# EAGLE schematic vaha_esp8266 (EAGLE 9.0.1)
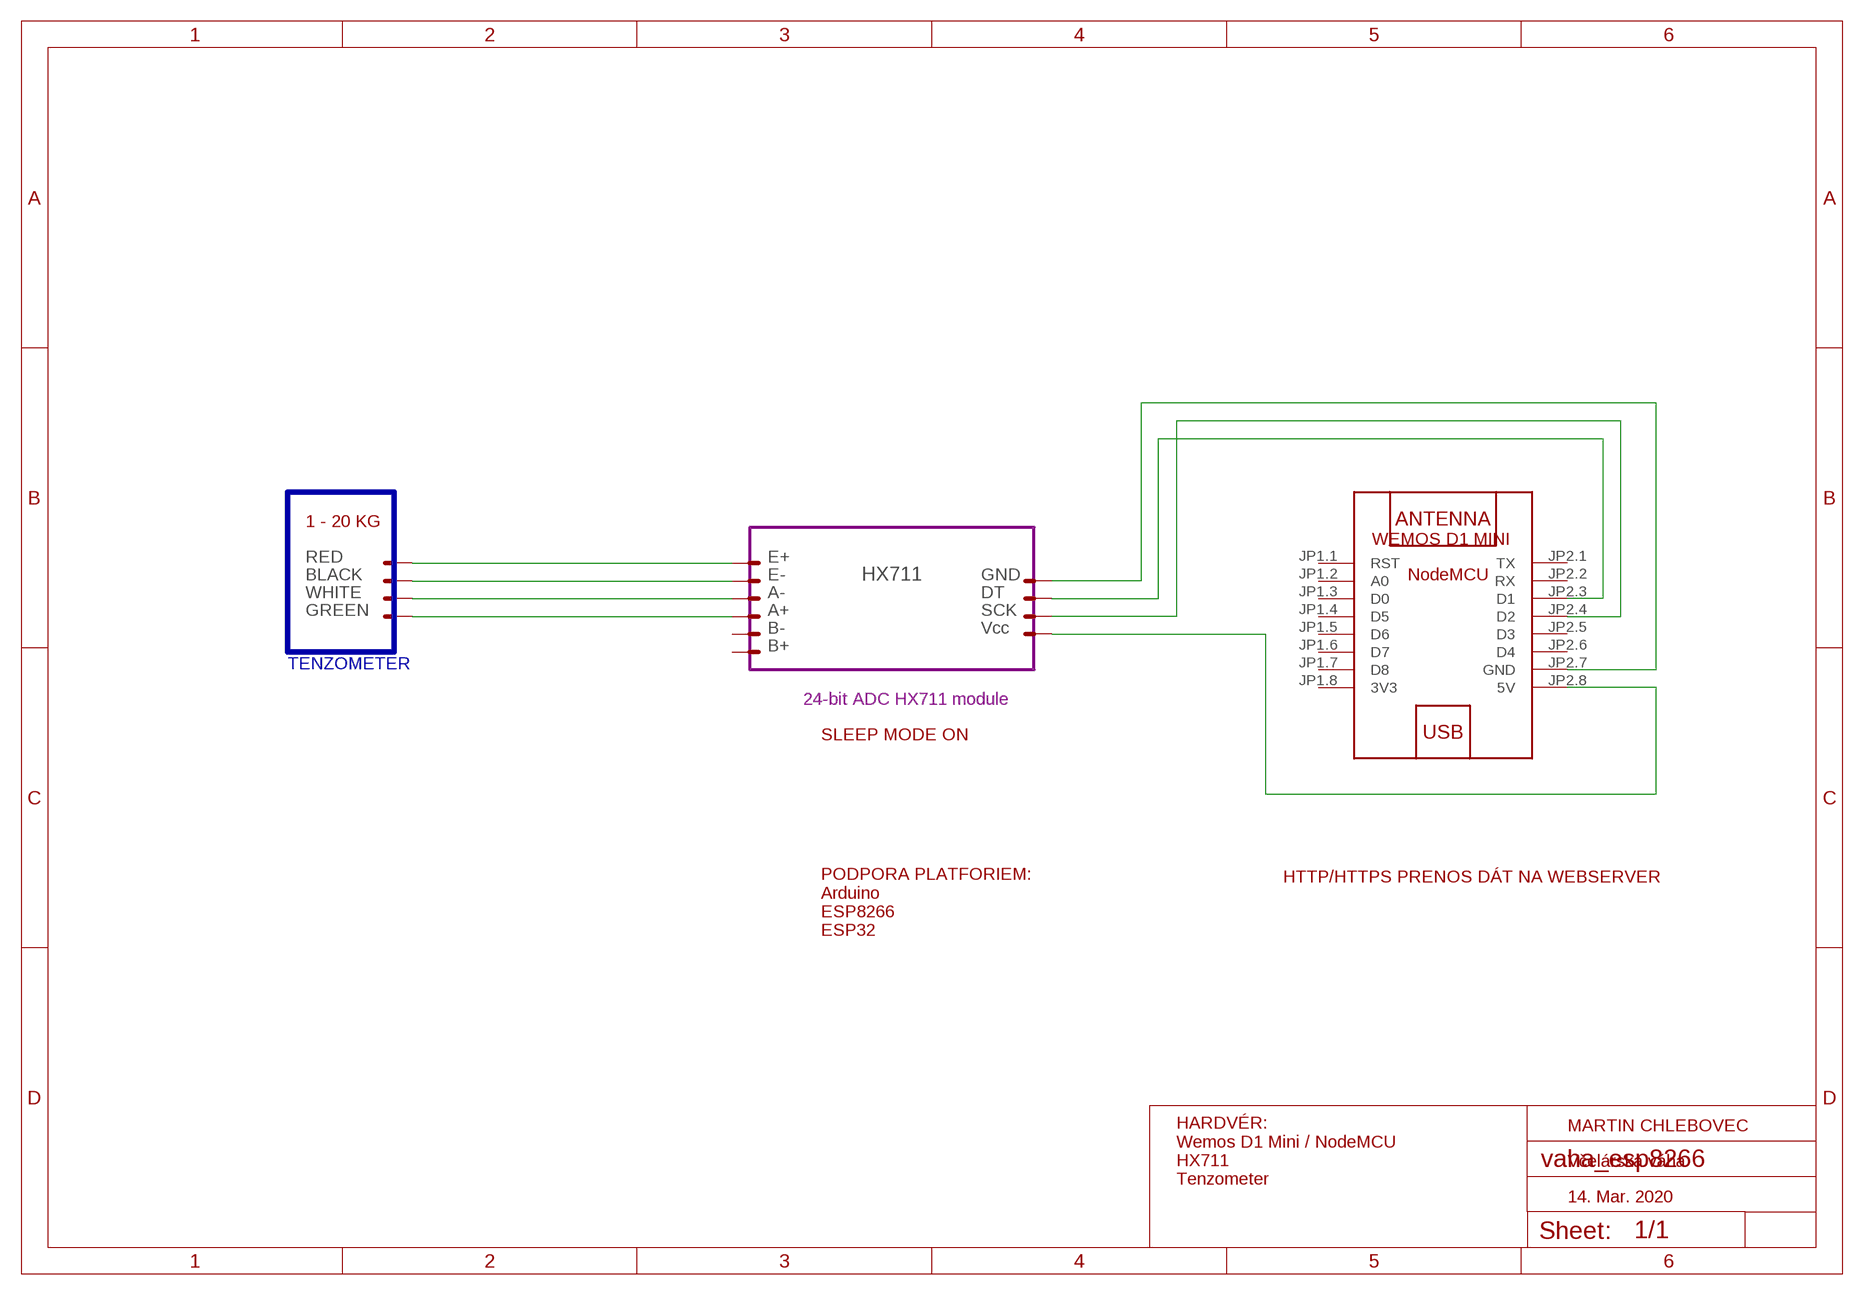
[diagram p0: schematic, sheet 1]

## Parts
U$1  WEMOS-D1-MINI  [WEMOS-D1-MINI]
X1  332-02  [332-02]
X2  332-02  [332-02]
X3  332-02  [332-02]
X4  332-02  [332-02]
X5  332-02  [332-02]
X6  332-02  [332-02]
X7  332-02  [332-02]
X8  332-02  [332-02]
X9  332-02  [332-02]
X10  332-02  [332-02]
X11  332-02  [332-02]
X12  332-02  [332-02]
X13  332-02  [332-02]

## Module instances
HX711 = HX711

## Nets
N$1: U$1.JP2.8(5V) X3.2
N$2: U$1.JP2.7(GND) X1.1
N$3: U$1.JP2.3(D1) X1.2
N$4: U$1.JP2.4(D2) X2.2
N$5: X4.2 X10.2
N$6: X5.2 X11.2
N$7: X6.2 X12.2
N$8: X7.2 X13.2
Unconnected: U$1.JP1.1(RST) U$1.JP1.2(A0) U$1.JP1.3(D0) U$1.JP1.4(D5) U$1.JP1.5(D6) U$1.JP1.6(D7) U$1.JP1.7(D8) U$1.JP2.1(TX) U$1.JP2.2(RX) U$1.JP2.5(D3) U$1.JP2.6(D4) X2.1 X3.1 X4.1 X5.1 X6.1 X7.1 X8.1 X8.2 X9.1 X9.2 X10.1 X11.1 X12.1 X13.1

## Buses
B$1

## Notes on the sheet
- 1 - 20 KG
- WEMOS D1 MINI
- RED | E+
- BLACK | E- | GND | NodeMCU
- WHITE | A- | DT
- GREEN | A+ | SCK
- B- | Vcc
- B+
- TENZOMETER
- 24-bit ADC HX711 module
- SLEEP MODE ON
- HTTP/HTTPS PRENOS DÁT NA WEBSERVER
- PODPORA PLATFORIEM:
  Arduino
  ESP8266
  ESP32
- MARTIN CHLEBOVEC
- Včelárska váha
- HARDVÉR:
  Wemos D1 Mini / NodeMCU
  HX711
  Tenzometer
- 14. Mar. 2020

## Power pins joined to a net without a drawn wire
3V3: U$1.JP1.8(3V3)

## Library data of the parts
U$1 = diy-modules:WEMOS-D1-MINI: WEMOS D1 mini: Mini Wi-Fi Board based on ESP-8266 device More details can be found here: https://www.wemos.cc/product/d1-mini.html Click here to find device on ebay.com <http://www.ebay.com/sch/wemos+d1+mini+nodemcu>
X1-X13 = con-garry:332-02: 2 Pin - 2mm Dual Row Source: www.mpe-connector.de / garry_shortform_2012.pdf

## Module HX711
Ports: 

### Library data of the parts